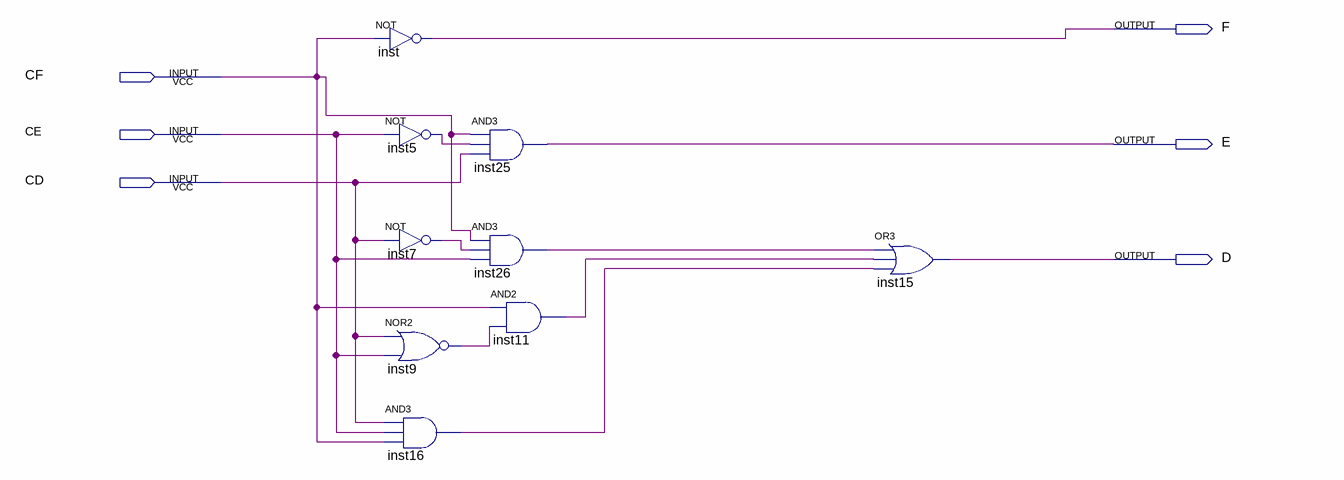
[diagram p0: schematic sheet]
// Quartus schematic Aula3.bdf as structural Verilog: 9 symbols, 6 pins
module Aula3 (
  input  CF,
  input  CE,
  input  CD,
  output F,
  output E,
  output D
);

  wire inst5_out, inst7_out, inst9_out, inst11_out, inst16_out, inst26_out;

  not inst (F, CF);
  not inst5 (inst5_out, CE);
  not inst7 (inst7_out, CD);
  nor inst9 (inst9_out, CD, CE);
  and inst16 (inst16_out, CD, CE, CF);
  and inst25 (E, CF, inst5_out, CD);
  and inst26 (inst26_out, CF, inst7_out, CE);
  and inst11 (inst11_out, CF, inst9_out);
  or inst15 (D, inst26_out, inst11_out, inst16_out);
endmodule
